# EAGLE design midiprog (EAGLE 6.5.0)
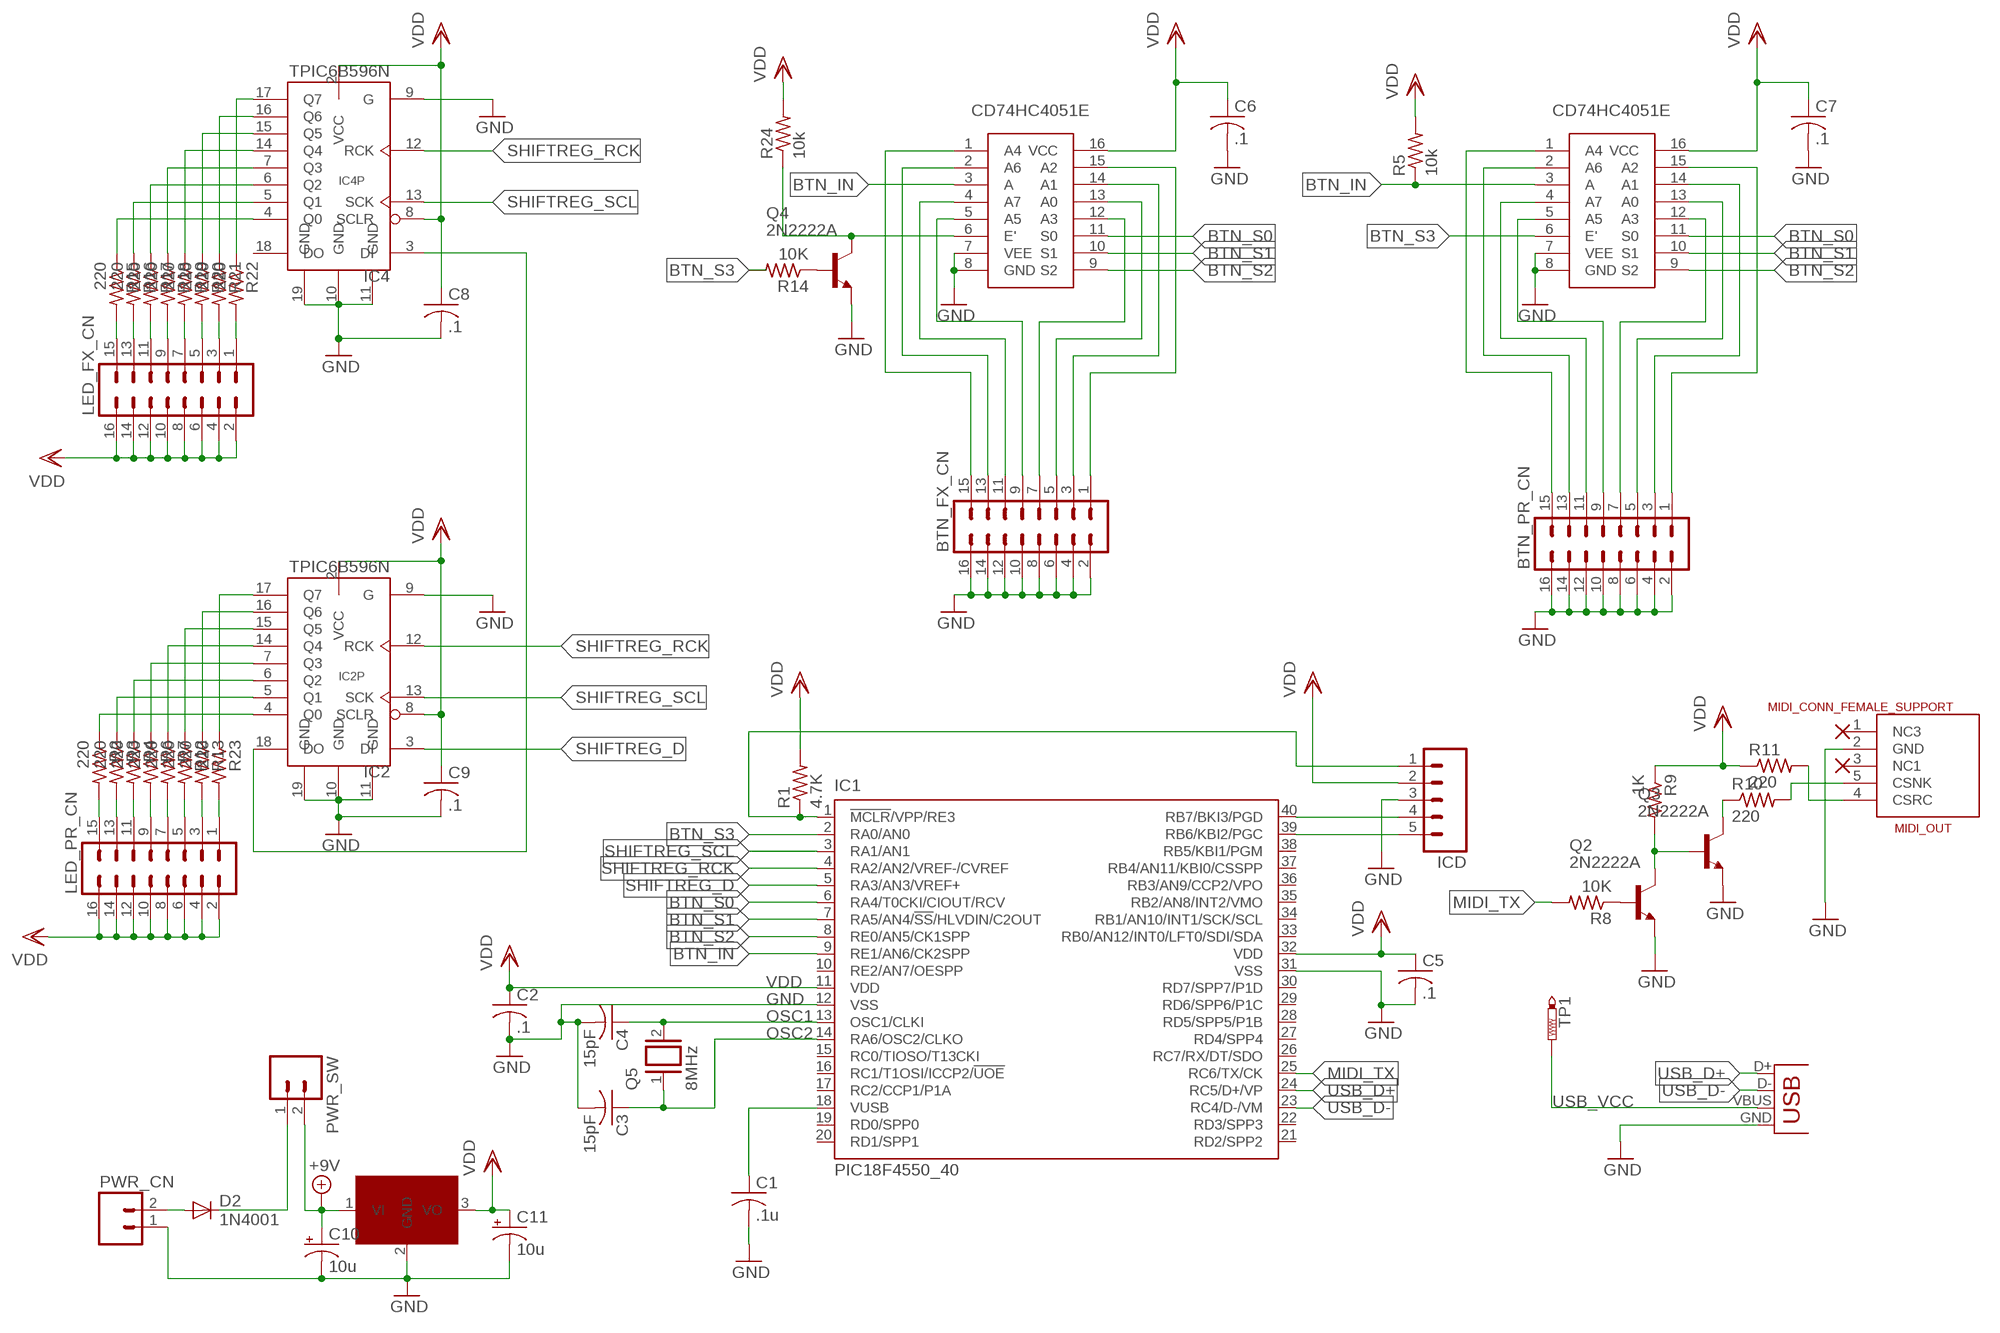
[diagram p0: schematic, sheet 1]

## Parts
BTN_FX_CN  MA08-2  [MA08-2]
BTN_PR_CN  MA08-2  [MA08-2]
C1  .1u  C-US050-025X075  [C050-025X075]
C2  .1  C-US050-025X075  [C050-025X075]
C3  15pF  C-US050-025X075  [C050-025X075]
C4  15pF  C-US050-025X075  [C050-025X075]
C5  .1  C-US050-025X075  [C050-025X075]
C6  .1  C-US050-025X075  [C050-025X075]
C7  .1  C-US050-025X075  [C050-025X075]
C8  .1  C-US050-025X075  [C050-025X075]
C9  .1  C-US050-025X075  [C050-025X075]
C10  10u  CPOL-USE2.5-6  [E2,5-6]
C11  10u  CPOL-USE2.5-6  [E2,5-6]
D2  1N4001  1N4004  [DO41-10]
IC1  PIC18F4550_40  [DIL40]
IC2  TPIC6B596N  [DIL20]
IC4  TPIC6B596N  [DIL20]
ICD  MA05  [05PA]
JP1  USB-B  USBPTH  [USB-B-PTH]
LED_FX_CN  MA08-2  [MA08-2]
LED_PR_CN  MA08-2  [MA08-2]
MIDI_OUT  MIDI_CONN_FEMALE_SUPPORT  [DIN_5_FEMALE_SUPPORT]
PWR_CN  M02  [02P]
PWR_SW  M02  [02P]
Q2  2N2222A  [TO18]
Q3  2N2222A  [TO18]
Q4  2N2222A  [TO18]
Q5  8MHz  XTAL/S  [QS]
R1  4.7K  R-US_0207/10  [0207/10]
R2  220  R-US_0207/10  [0207/10]
R3  220  R-US_0207/10  [0207/10]
R4  220  R-US_0207/10  [0207/10]
R5  10k  R-US_0207/10  [0207/10]
R6  220  R-US_0207/10  [0207/10]
R7  220  R-US_0207/10  [0207/10]
R8  10K  R-US_0207/10  [0207/10]
R9  1K  R-US_0207/10  [0207/10]
R10  220  R-US_0207/10  [0207/10]
R11  220  R-US_0207/10  [0207/10]
R12  220  R-US_0207/10  [0207/10]
R13  220  R-US_0207/10  [0207/10]
R14  10K  R-US_0207/10  [0207/10]
R15  220  R-US_0207/10  [0207/10]
R16  220  R-US_0207/10  [0207/10]
R17  220  R-US_0207/10  [0207/10]
R18  220  R-US_0207/10  [0207/10]
R19  220  R-US_0207/10  [0207/10]
R20  220  R-US_0207/10  [0207/10]
R21  220  R-US_0207/10  [0207/10]
R22  220  R-US_0207/10  [0207/10]
R23  220  R-US_0207/10  [0207/10]
R24  10k  R-US_0207/10  [0207/10]
TP1  PTR1PAD1-17  [P1-17]
U$1  CD74HC4051E  [CD74HC4051E]
U$2  CD74HC4051E  [CD74HC4051E]
U$3  7805  [JKDFJD]

## Nets
+9V: C10.+ PWR_SW.2 U$3.1(VI)
BTN_IN: IC1.9(RE1/AN6/CK2SPP) R5.1 U$1.3(A) U$2.3(A)
BTN_S0: IC1.6(RA4/T0CKI/CIOUT/RCV) U$1.11(S0) U$2.11(S0)
BTN_S1: IC1.7(RA5/AN4/!SS!/HLVDIN/C2OUT) U$1.10(S1) U$2.10(S1)
BTN_S2: IC1.8(RE0/AN5/CK1SPP) U$1.9(S2) U$2.9(S2)
BTN_S3: IC1.2(RA0/AN0) R14.2 U$1.6(E')
GND: BTN_FX_CN.2 BTN_FX_CN.4 BTN_FX_CN.6 BTN_FX_CN.8 BTN_FX_CN.10 BTN_FX_CN.12 BTN_FX_CN.14 BTN_FX_CN.16 BTN_PR_CN.2 BTN_PR_CN.4 BTN_PR_CN.6 BTN_PR_CN.8 BTN_PR_CN.10 BTN_PR_CN.12 BTN_PR_CN.14 BTN_PR_CN.16 C1.2 C2.2 C3.2 C4.2 C5.2 C6.2 C7.2 C8.2 C9.2 C10.- C11.- IC1.12(VSS) IC1.31(VSS) IC2.9(G) IC2.10(GND) IC2.11(GND) IC2.19(GND) IC4.9(G) IC4.10(GND) IC4.11(GND) IC4.19(GND) ICD.3 JP1.GND MIDI_OUT.2(GND) PWR_CN.1 Q2.1(E) Q3.1(E) Q4.1(E) U$1.7(VEE) U$1.8(GND) U$2.7(VEE) U$2.8(GND) U$3.2(GND)
MIDI_TX: IC1.25(RC6/TX/CK) R8.2
N$1: IC1.1(!MCLR!/VPP/RE3) ICD.1 R1.1
N$2: LED_FX_CN.15 R15.2
N$3: LED_FX_CN.13 R16.2
N$4: Q2.2(B) R8.1
N$5: Q2.3(C) Q3.2(B) R9.2
N$6: LED_PR_CN.15 R2.2
N$7: Q3.3(C) R10.1
N$8: MIDI_OUT.4(CSRC) R11.2
N$9: MIDI_OUT.5(CSNK) R10.2
N$10: LED_FX_CN.11 R17.2
N$11: LED_FX_CN.9 R18.2
N$12: LED_FX_CN.7 R19.2
N$13: LED_FX_CN.5 R20.2
N$14: LED_FX_CN.3 R21.2
N$15: LED_FX_CN.1 R22.2
N$16: IC1.39(RB6/KBI2/PGC) ICD.5
N$17: IC1.40(RB7/BKI3/PGD) ICD.4
N$18: C1.1 IC1.18(VUSB)
N$19: IC4.4(Q0) R15.1
N$20: IC4.5(Q1) R16.1
N$21: IC4.6(Q2) R17.1
N$22: IC4.7(Q3) R18.1
N$23: IC4.14(Q4) R19.1
N$24: LED_PR_CN.13 R3.2
N$25: IC4.15(Q5) R20.1
N$26: IC4.16(Q6) R21.1
N$27: LED_PR_CN.11 R4.2
N$28: LED_PR_CN.9 R6.2
N$29: IC4.17(Q7) R22.1
N$30: LED_PR_CN.7 R7.2
N$31: IC2.18(DO) IC4.3(DI)
N$32: LED_PR_CN.5 R12.2
N$34: D2.A PWR_CN.2
N$35: D2.C PWR_SW.1
N$36: LED_PR_CN.3 R13.2
N$37: LED_PR_CN.1 R23.2
N$38: IC2.4(Q0) R2.1
N$39: IC2.5(Q1) R3.1
N$40: IC2.6(Q2) R4.1
N$41: IC2.7(Q3) R6.1
N$42: IC2.14(Q4) R7.1
N$43: IC2.15(Q5) R12.1
N$44: IC2.16(Q6) R13.1
N$45: IC2.17(Q7) R23.1
N$46: BTN_FX_CN.9 U$2.5(A5)
N$47: BTN_PR_CN.9 U$1.5(A5)
N$48: BTN_FX_CN.11 U$2.4(A7)
N$49: BTN_FX_CN.13 U$2.2(A6)
N$50: BTN_PR_CN.11 U$1.4(A7)
N$51: BTN_PR_CN.13 U$1.2(A6)
N$52: BTN_PR_CN.15 U$1.1(A4)
N$53: Q4.2(B) R14.1
N$54: Q4.3(C) R24.1 U$2.6(E')
N$55: BTN_PR_CN.7 U$1.12(A3)
N$56: BTN_PR_CN.5 U$1.13(A0)
N$57: BTN_PR_CN.3 U$1.14(A1)
N$58: BTN_PR_CN.1 U$1.15(A2)
N$60: BTN_FX_CN.15 U$2.1(A4)
N$61: BTN_FX_CN.7 U$2.12(A3)
N$62: BTN_FX_CN.5 U$2.13(A0)
N$63: BTN_FX_CN.3 U$2.14(A1)
N$64: BTN_FX_CN.1 U$2.15(A2)
OSC1: C4.1 IC1.13(OSC1/CLKI) Q5.2
OSC2: C3.1 IC1.14(RA6/OSC2/CLKO) Q5.1
SHIFTREG_D: IC1.5(RA3/AN3/VREF+) IC2.3(DI)
SHIFTREG_RCK: IC1.4(RA2/AN2/VREF-/CVREF) IC2.12(RCK) IC4.12(RCK)
SHIFTREG_SCL: IC1.3(RA1/AN1) IC2.13(SCK) IC4.13(SCK)
USB_D+: IC1.24(RC5/D+/VP) JP1.D+
USB_D-: IC1.23(RC4/D-/VM) JP1.D-
USB_VCC: JP1.VBUS TP1.TP
VDD: C2.1 C5.1 C6.1 C7.1 C8.1 C9.1 C11.+ IC1.11(VDD) IC1.32(VDD) IC2.2(VCC) IC2.8(SCLR) IC4.2(VCC) IC4.8(SCLR) ICD.2 LED_FX_CN.2 LED_FX_CN.4 LED_FX_CN.6 LED_FX_CN.8 LED_FX_CN.10 LED_FX_CN.12 LED_FX_CN.14 LED_FX_CN.16 LED_PR_CN.2 LED_PR_CN.4 LED_PR_CN.6 LED_PR_CN.8 LED_PR_CN.10 LED_PR_CN.12 LED_PR_CN.14 LED_PR_CN.16 R1.2 R5.2 R9.1 R11.1 R24.2 U$1.16(VCC) U$2.16(VCC) U$3.3(VO)
Unconnected: IC1.10(RE2/AN7/OESPP) IC1.15(RC0/TIOSO/T13CKI) IC1.16(RC1/T1OSI/ICCP2/!UOE) IC1.17(RC2/CCP1/P1A) IC1.19(RD0/SPP0) IC1.20(RD1/SPP1) IC1.21(RD2/SPP2) IC1.22(RD3/SPP3) IC1.26(RC7/RX/DT/SDO) IC1.27(RD4/SPP4) IC1.28(RD5/SPP5/P1B) IC1.29(RD6/SPP6/P1C) IC1.30(RD7/SPP7/P1D) IC1.33(RB0/AN12/INT0/LFT0/SDI/SDA) IC1.34(RB1/AN10/INT1/SCK/SCL) IC1.35(RB2/AN8/INT2/VMO) IC1.36(RB3/AN9/CCP2/VPO) IC1.37(RB4/AN11/KBI0/CSSPP) IC1.38(RB5/KBI1/PGM) IC4.18(DO) MIDI_OUT.1(NC3) MIDI_OUT.3(NC1)

## Library data of the parts
BTN_FX_CN BTN_PR_CN LED_FX_CN LED_PR_CN = con-lstb:MA08-2: PIN HEADER; OC_FARNELL: unknown; OC_NEWARK: unknown
C1-C9 = rcl:C-US: CAPACITOR, American symbol
C10 C11 = rcl:CPOL-US: POLARIZED CAPACITOR, American symbol
D2 = diode:1N4004: DIODE general purpose rectifier, 1 A
IC1 = microchip:PIC18F4*_40: USB Microcontrollers with nanoWatt Technology High-Performance, Enhanced Flash, 28/40/44-Pin, Source: http://ww1.microchip.com/downloads/en/devicedoc/39632c.pdf; MF: MICROCHIP; MPN: PIC18F4550-I/P; OC_FARNELL: 9321357; OC_NEWARK: 74K8623
IC2 IC4 = tpic:TPIC6B596
ICD = con-amp-quick:MA05: AMP QUICK CONNECTOR; OC_FARNELL: unknown; OC_NEWARK: unknown
JP1 = SparkFun-Connectors-fdb4deb3ddf02d02cecaec8c0f5c972a585683b1:USB: USB Connectors USB-B-PTH is fully proven SKU : PRT-00139/CONN-08278 USB-miniB is fully proven SKU : PRT-00587 USB-A-PCB is untested. USB-A-H is throughly reviewed, but untested. Spark Fun Electronics SKU : PRT-00437 USB-B-SMT is throughly reviewed, but untested. Needs silkscreen touching up. USB-A-S has not been used/tested USB-MB-H has not been used/tested USB-MICROB has been used. CONN-09505; PROD_ID: CONN-08278
MIDI_OUT = SparkFun-Connectors-fdb4deb3ddf02d02cecaec8c0f5c972a585683b1:MIDI_CONN_FEMALE_SUPPORT: MIDI connector with strain relief (DIN-5 female)
PWR_CN PWR_SW = con-amp-quick:M02: AMP QUICK CONNECTOR; OC_FARNELL: unknown; OC_NEWARK: unknown
Q2-Q4 = transistor-npn:2N2222*: NPN Transistor
Q5 = special:XTAL/S: CRYSTAL
R1-R24 = rcl:R-US_: RESISTOR, American symbol
TP1 = testpad:PTR1: TEST PIN
U$1 U$2 = joe:CD74HC4051E
U$3 = 7805:7805

## Board
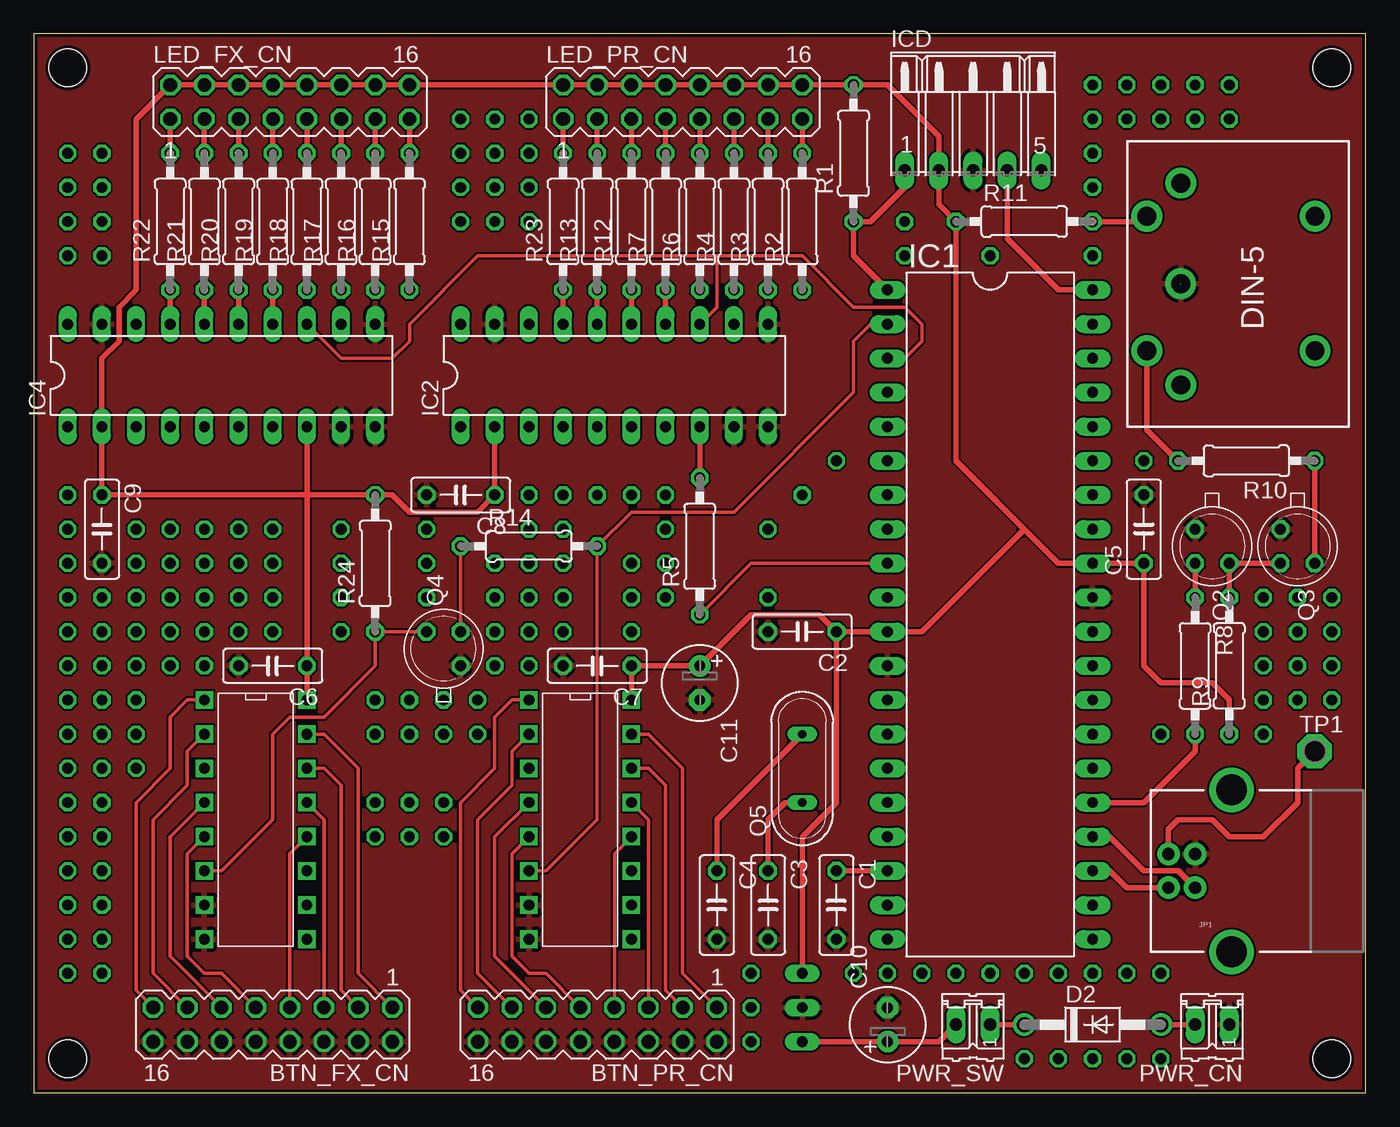
[diagram p1: board, top side]
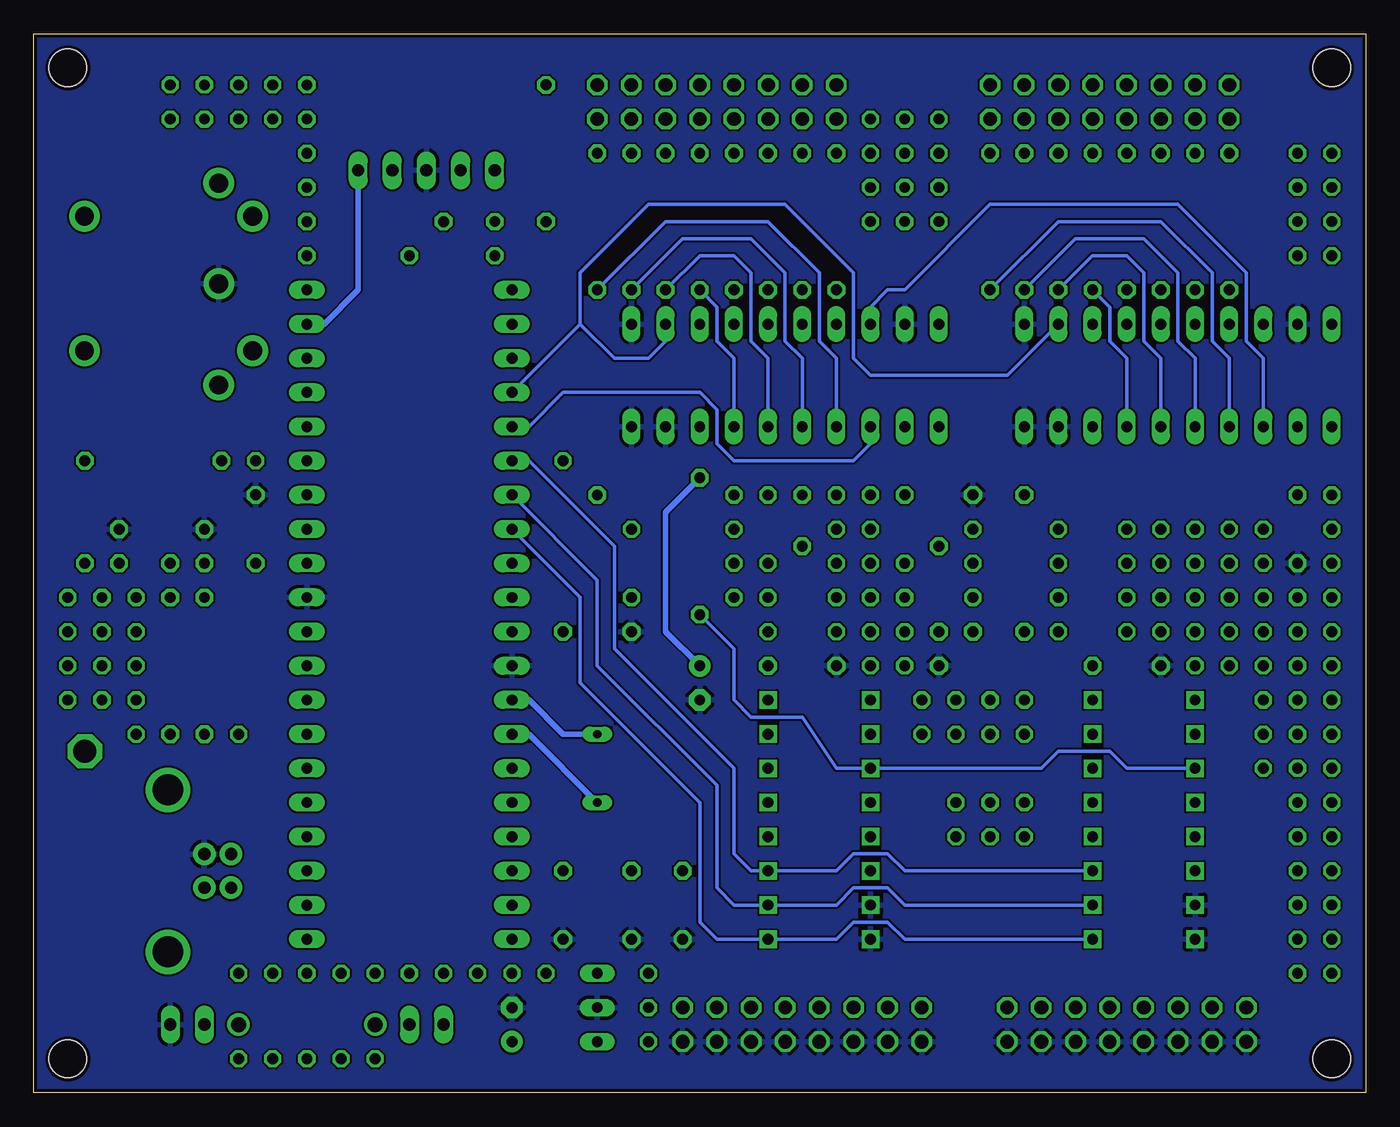
[diagram p2: board, bottom side, seen from below]

Size 99.06 x 78.74 mm. Coordinates in mm from the lower left corner, seen from the top.
Outline: 0,0 99.06,0 99.06,78.74 0,78.74 0,0
Copper layers (1*16): Top 0.035mm / dielectric 1.5mm / Bottom 0.035mm
Design rules "SeeedStudio_DRU-2layer_no_angle_20130527": minimum track width 6mil, minimum drill 12mil, track to track 6mil, track to pad 6mil, pad to pad 6mil, via to via 6mil, smd to smd 0mil, copper to edge 10mil, drill to drill 10mil, minimum pad ring 10mil, minimum via ring 6mil, stop-mask expansion 2mil, vias tented up to drill 25mil, thermal gap 10mil
Holes 2.8 mm at 2.54,76.2 2.54,2.54 96.52,2.54 96.52,76.2

### Footprints (pad centres in the part's own frame; a part is rotated, then mirrored left to right if it is on the bottom)
MA08-2 = drill 1.016 octagon: 1 -8.89,-1.27; 2 -8.89,1.27; 3 -6.35,-1.27; 4 -6.35,1.27; 5 -3.81,-1.27; 6 -3.81,1.27; 7 -1.27,-1.27; 8 -1.27,1.27; 9 1.27,-1.27; 10 1.27,1.27; 11 3.81,-1.27; 12 3.81,1.27; 13 6.35,-1.27; 14 6.35,1.27; 15 8.89,-1.27; 16 8.89,1.27
C050-025X075 = drill 0.813 octagon: 1 -2.54,0; 2 2.54,0
E2,5-6 = drill 0.813 pad 1.6: + -1.27,0 | drill 0.813 pad 1.6 octagon: - 1.27,0
DO41-10 = drill 1.118: A 5.08,0; C -5.08,0
DIL40 = drill 0.813 long: 1 -24.13,-7.62; 2 -21.59,-7.62; 3 -19.05,-7.62; 4 -16.51,-7.62; 5 -13.97,-7.62; 6 -11.43,-7.62; 7 -8.89,-7.62; 8 -6.35,-7.62; 9 -3.81,-7.62; 10 -1.27,-7.62; 11 1.27,-7.62; 12 3.81,-7.62; 13 6.35,-7.62; 14 8.89,-7.62; 15 11.43,-7.62; 16 13.97,-7.62; 17 16.51,-7.62; 18 19.05,-7.62; 19 21.59,-7.62; 20 24.13,-7.62; 21 24.13,7.62; 22 21.59,7.62; 23 19.05,7.62; 24 16.51,7.62; 25 13.97,7.62; 26 11.43,7.62; 27 8.89,7.62; 28 6.35,7.62; 29 3.81,7.62; 30 1.27,7.62; 31 -1.27,7.62; 32 -3.81,7.62; 33 -6.35,7.62; 34 -8.89,7.62; 35 -11.43,7.62; 36 -13.97,7.62; 37 -16.51,7.62; 38 -19.05,7.62; 39 -21.59,7.62; 40 -24.13,7.62
DIL20 = drill 0.813 long: 1 -11.43,-3.81; 2 -8.89,-3.81; 3 -6.35,-3.81; 4 -3.81,-3.81; 5 -1.27,-3.81; 6 1.27,-3.81; 7 3.81,-3.81; 8 6.35,-3.81; 9 8.89,-3.81; 10 11.43,-3.81; 11 11.43,3.81; 12 8.89,3.81; 13 6.35,3.81; 14 3.81,3.81; 15 1.27,3.81; 16 -1.27,3.81; 17 -3.81,3.81; 18 -6.35,3.81; 19 -8.89,3.81; 20 -11.43,3.81
05PA = drill 0.914 long: 1 -5.08,0; 2 -2.54,0; 3 0,0; 4 2.54,0; 5 5.08,0
USB-B-PTH = drill 0.914 pad 1.676: D+ 0,1.25; D- 1.981,1.25; GND 0,-1.25; VBUS 1.981,-1.25 | drill 2.286: S1 -2.718,-6.02; S2 -2.718,6.02
DIN_5_FEMALE_SUPPORT = drill 1.4 pad 2.286: 1 7.94,3.6; 2 0.46,3.61; 3 -7.07,3.6; 4 5.47,6.13; 5 -4.53,6.12; 6 -4.53,-6.382; 7 5.478,-6.382
02P = drill 0.914 long: 1 -1.27,0; 2 1.27,0
TO18 = drill 0.813 octagon: 1 -1.27,-1.27; 2 1.27,-1.27; 3 1.27,1.27
QS = drill 0.61 long: 1 -2.54,0; 2 2.54,0
0207/10 = drill 0.813 octagon: 1 -5.08,0; 2 5.08,0
P1-17 = drill 1.702 pad 2.54 octagon: TP 0,0
CD74HC4051E = drill 0.8 square: 1 -10.16,-7.62; 2 -7.62,-7.62; 3 -5.08,-7.62; 4 -2.54,-7.62; 5 0,-7.62; 6 2.54,-7.62; 7 5.08,-7.62; 8 7.62,-7.62; 9 7.62,0; 10 5.08,0; 11 2.54,0; 12 0,0; 13 -2.54,0; 14 -5.08,0; 15 -7.62,0; 16 -10.16,0
JKDFJD = drill 0.8 long: 1 -2.54,0; 2 0,0; 3 2.54,0

### Placement (x,y rotation side)
BTN_FX_CN  17.78,5.08 180 top
BTN_PR_CN  41.91,5.08 180 top
C1  59.69,13.97 270 top
C2  57.15,34.29 180 top
C3  54.61,13.97 270 top
C4  50.8,13.97 270 top
C5  82.55,41.91 90 top
C6  17.78,31.75 180 top
C7  41.91,31.75 180 top
C8  31.75,44.45 180 top
C9  5.08,41.91 270 top
C10  63.5,5.08 90 top
C11  49.53,30.48 270 top
D2  78.74,5.08 0 top
IC1  71.12,35.56 270 top
IC2  43.18,53.34 0 top
IC4  13.97,53.34 0 top
ICD  69.85,68.58 0 top
JP1  86.36,16.51 180 top
LED_FX_CN  19.05,73.66 0 top
LED_PR_CN  48.26,73.66 0 top
MIDI_OUT  88.9,59.69 90 top
PWR_CN  87.63,5.08 180 top
PWR_SW  69.85,5.08 180 top
Q2  87.63,40.64 270 top
Q3  93.98,40.64 270 top
Q4  30.48,33.02 90 top
Q5  57.15,24.13 90 top
R1  60.96,69.85 90 top
R2  57.15,64.77 90 top
R3  54.61,64.77 90 top
R4  52.07,64.77 90 top
R5  49.53,40.64 90 top
R6  49.53,64.77 90 top
R7  46.99,64.77 90 top
R8  86.36,31.75 270 top
R9  88.9,31.75 90 top
R10  90.17,46.99 180 top
R11  73.66,64.77 0 top
R12  44.45,64.77 90 top
R13  41.91,64.77 90 top
R14  36.83,40.64 0 top
R15  27.94,64.77 90 top
R16  25.4,64.77 90 top
R17  22.86,64.77 90 top
R18  20.32,64.77 90 top
R19  17.78,64.77 90 top
R20  15.24,64.77 90 top
R21  12.7,64.77 90 top
R22  10.16,64.77 90 top
R23  39.37,64.77 90 top
R24  25.4,39.37 90 top
TP1  95.25,25.4 0 top
U$1  44.45,19.05 270 top
U$2  20.32,19.05 270 top
U$3  57.15,6.35 90 top

### Tracks (layer width: path | path; a pad name or v marks a point on that pad's centre or on a via)
+9V
  Top 0.406: U$3.1 C10.+ 67.31,3.81 PWR_SW.2
BTN_IN
  Top 0.254: IC1.9 53.34,39.37 R5.1
  Bottom 0.254: R5.1 46.99,33.02 46.99,29.21 45.72,27.94 41.91,27.94 39.37,24.13 U$1.3 24.13,24.13 22.86,25.4 19.05,25.4 17.78,24.13 U$2.3
BTN_S0
  Bottom 0.254: IC1.6 62.23,46.99 55.88,40.64 55.88,33.02 46.99,24.13 46.99,17.78 45.72,16.51 U$1.11 39.37,16.51 38.1,17.78 35.56,17.78 34.29,16.51 U$2.11
BTN_S1
  Bottom 0.254: IC1.7 57.15,38.1 57.15,31.75 48.26,22.86 48.26,15.24 46.99,13.97 U$1.10 39.37,13.97 38.1,15.24 35.56,15.24 34.29,13.97 U$2.10
BTN_S2
  Bottom 0.254: IC1.8 58.42,36.83 58.42,30.48 49.53,21.59 49.53,12.7 48.26,11.43 U$1.9 39.37,11.43 38.1,12.7 35.56,12.7 34.29,11.43 U$2.9
BTN_S3
  Top 0.254: IC1.2 62.23,57.15 60.96,55.88 60.96,52.07 52.07,43.18 44.45,43.18 R14.2 41.91,20.32 38.1,16.51 U$1.6
GND
  pour Bottom: -1.27,80.01 100.33,80.01 100.33,-1.27 -1.27,-1.27
  pour Top: -2.54,81.28 101.6,81.28 101.6,-2.54 -2.54,-2.54
MIDI_TX
  Top 0.406: IC1.25 82.55,21.59 86.36,25.4 R8.2
N$1
  Top 0.406: ICD.1 64.77,67.31 62.23,64.77 R1.1 60.96,62.23 IC1.1
N$2
  Top 0.406: LED_FX_CN.15 R15.2
N$3
  Top 0.406: LED_FX_CN.13 R16.2
N$4
  Top 0.406: R8.1 Q2.2
N$5
  Top 0.406: R9.2 Q2.3 Q3.2
N$6
  Top 0.406: LED_PR_CN.15 R2.2
N$7
  Top 0.406: Q3.3 R10.1
N$8
  Top 0.406: R11.2 82.38,64.77 MIDI_OUT.4
N$9
  Top 0.406: MIDI_OUT.5 82.78,49.3 R10.2
N$10
  Top 0.406: LED_FX_CN.11 R17.2
N$11
  Top 0.406: LED_FX_CN.9 R18.2
N$12
  Top 0.406: LED_FX_CN.7 R19.2
N$13
  Top 0.406: LED_FX_CN.5 R20.2
N$14
  Top 0.406: LED_FX_CN.3 R21.2
N$15
  Top 0.406: LED_FX_CN.1 R22.2
N$16
  Bottom 0.406: ICD.5 74.93,59.69 77.47,57.15 IC1.39
N$17
  Top 0.406: ICD.4 72.39,63.5 76.2,59.69 IC1.40
N$18
  Top 0.406: IC1.18 C1.1
N$19
  Bottom 0.254: IC4.4 10.16,54.61 11.43,55.88 11.43,60.96 15.24,64.77 22.86,64.77 R15.1
N$20
  Bottom 0.254: IC4.5 12.7,54.61 13.97,55.88 13.97,60.96 16.51,63.5 21.59,63.5 R16.1
N$21
  Bottom 0.254: IC4.6 15.24,54.61 16.51,55.88 16.51,60.96 17.78,62.23 20.32,62.23 R17.1
N$22
  Bottom 0.254: IC4.7 17.78,54.61 19.05,55.88 19.05,58.42 R18.1
N$23
  Top 0.406: R19.1 IC4.14
N$24
  Top 0.406: LED_PR_CN.13 R3.2
N$25
  Top 0.406: R20.1 IC4.15
N$26
  Top 0.406: R21.1 IC4.16
N$27
  Top 0.406: LED_PR_CN.11 R4.2
N$28
  Top 0.406: LED_PR_CN.9 R6.2
N$29
  Top 0.406: R22.1 IC4.17
N$30
  Top 0.406: LED_PR_CN.7 R7.2
N$31
  Bottom 0.254: IC4.3 7.62,54.61 8.89,55.88 8.89,60.96 13.97,66.04 27.94,66.04 34.29,59.69 35.56,59.69 36.83,58.42 IC2.18
N$32
  Top 0.406: LED_PR_CN.5 R12.2
N$33  (via drill 0.8 pad 1.27)
  other vias: 17.78,41.91
N$34
  Top 0.406: D2.A PWR_CN.2
N$35
  Top 0.406: PWR_SW.1 D2.C
N$36
  Top 0.406: LED_PR_CN.3 R13.2
N$37
  Top 0.406: LED_PR_CN.1 R23.2
N$38
  Bottom 0.254: IC2.4 39.37,54.61 40.64,55.88 40.64,60.96 44.45,64.77 52.07,64.77 R2.1
N$39
  Bottom 0.254: IC2.5 41.91,54.61 43.18,55.88 43.18,60.96 45.72,63.5 50.8,63.5 R3.1
N$40
  Bottom 0.254: IC2.6 44.45,54.61 45.72,55.88 45.72,60.96 46.99,62.23 49.53,62.23 R4.1
N$41
  Bottom 0.254: IC2.7 46.99,54.61 48.26,55.88 48.26,58.42 R6.1
N$42
  Top 0.406: R7.1 IC2.14
N$43
  Top 0.406: R12.1 IC2.15
N$44
  Top 0.406: R13.1 IC2.16
N$45
  Top 0.406: R23.1 IC2.17
N$46
  Top 0.254: U$2.5 11.43,17.78 11.43,10.16 12.7,8.89 13.97,8.89 BTN_FX_CN.9
N$47
  Top 0.254: U$1.5 35.56,17.78 35.56,10.16 36.83,8.89 38.1,8.89 BTN_PR_CN.9
N$48
  Top 0.254: U$2.4 10.16,19.05 10.16,10.16 BTN_FX_CN.11
N$49
  Top 0.254: U$2.2 11.43,25.4 11.43,22.86 8.89,20.32 8.89,8.89 BTN_FX_CN.13
N$50
  Top 0.254: U$1.4 34.29,19.05 34.29,10.16 BTN_PR_CN.11
N$51
  Top 0.254: U$1.2 35.56,25.4 35.56,22.86 33.02,20.32 33.02,8.89 BTN_PR_CN.13
N$52
  Top 0.254: U$1.1 35.56,29.21 34.29,27.94 34.29,24.13 31.75,21.59 31.75,7.62 BTN_PR_CN.15
N$53
  Top 0.254: R14.1 Q4.2
N$54
  Top 0.254: Q4.3 R24.1 25.4,31.75 21.59,27.94 19.05,27.94 17.78,26.67 17.78,20.32 13.97,16.51 U$2.6
N$55
  Top 0.254: U$1.12 43.18,17.78 BTN_PR_CN.7
N$56
  Top 0.254: U$1.13 45.72,20.32 BTN_PR_CN.5
N$57
  Top 0.254: U$1.14 45.72,24.13 46.99,22.86 46.99,7.62 BTN_PR_CN.3
N$58
  Top 0.254: U$1.15 45.72,26.67 48.26,24.13 48.26,8.89 BTN_PR_CN.1
N$59  (via drill 0.8 pad 1.27)
  other vias: 15.24,41.91
N$60
  Top 0.254: U$2.1 11.43,29.21 10.16,27.94 10.16,24.13 7.62,21.59 7.62,7.62 BTN_FX_CN.15
N$61
  Top 0.254: U$2.12 19.05,17.78 BTN_FX_CN.7
N$62
  Top 0.254: U$2.13 21.59,20.32 BTN_FX_CN.5
N$63
  Top 0.254: U$2.14 21.59,24.13 22.86,22.86 22.86,7.62 BTN_FX_CN.3
N$64
  Top 0.254: U$2.15 21.59,26.67 24.13,24.13 24.13,8.89 BTN_FX_CN.1
N$65  (via drill 0.8 pad 1.27)
  other vias: 12.7,41.91
N$66  (via drill 0.8 pad 1.27)
  other vias: 10.16,41.91
N$67  (via drill 0.8 pad 1.27)
  other vias: 10.16,39.37
N$68  (via drill 0.8 pad 1.27)
  other vias: 12.7,39.37
N$69  (via drill 0.8 pad 1.27)
  other vias: 15.24,39.37
N$70  (via drill 0.8 pad 1.27)
  other vias: 17.78,39.37
N$71  (via drill 0.8 pad 1.27)
  other vias: 17.78,36.83
N$72  (via drill 0.8 pad 1.27)
  other vias: 15.24,36.83
N$73  (via drill 0.8 pad 1.27)
  other vias: 12.7,36.83
N$74  (via drill 0.8 pad 1.27)
  other vias: 10.16,36.83
N$75  (via drill 0.8 pad 1.27)
  other vias: 10.16,34.29
N$76  (via drill 0.8 pad 1.27)
  other vias: 12.7,34.29
N$77  (via drill 0.8 pad 1.27)
  other vias: 15.24,34.29
N$78  (via drill 0.8 pad 1.27)
  other vias: 17.78,34.29
N$79  (via drill 0.8 pad 1.27)
  other vias: 7.62,36.83
N$80  (via drill 0.8 pad 1.27)
  other vias: 7.62,34.29
N$81  (via drill 0.8 pad 1.27)
  other vias: 7.62,31.75
N$82  (via drill 0.8 pad 1.27)
  other vias: 10.16,31.75
N$83  (via drill 0.8 pad 1.27)
  other vias: 12.7,31.75
N$84  (via drill 0.8 pad 1.27)
  other vias: 5.08,31.75
N$85  (via drill 0.8 pad 1.27)
  other vias: 5.08,34.29
N$86  (via drill 0.8 pad 1.27)
  other vias: 5.08,36.83
N$87  (via drill 0.8 pad 1.27)
  other vias: 2.54,36.83
N$88  (via drill 0.8 pad 1.27)
  other vias: 2.54,39.37
N$89  (via drill 0.8 pad 1.27)
  other vias: 2.54,41.91
N$90  (via drill 0.8 pad 1.27)
  other vias: 7.62,41.91
N$91  (via drill 0.8 pad 1.27)
  other vias: 7.62,39.37
N$92  (via drill 0.8 pad 1.27)
  other vias: 2.54,34.29
N$93  (via drill 0.8 pad 1.27)
  other vias: 2.54,31.75
N$94  (via drill 0.8 pad 1.27)
  other vias: 33.02,29.21
N$95  (via drill 0.8 pad 1.27)
  other vias: 30.48,29.21
N$96  (via drill 0.8 pad 1.27)
  other vias: 5.08,69.85
N$97  (via drill 0.8 pad 1.27)
  other vias: 2.54,69.85
N$98  (via drill 0.8 pad 1.27)
  other vias: 2.54,67.31
N$99  (via drill 0.8 pad 1.27)
  other vias: 5.08,67.31
N$100  (via drill 0.8 pad 1.27)
  other vias: 5.08,64.77
N$101  (via drill 0.8 pad 1.27)
  other vias: 2.54,64.77
N$102  (via drill 0.8 pad 1.27)
  other vias: 2.54,62.23
N$103  (via drill 0.8 pad 1.27)
  other vias: 44.45,36.83
N$104  (via drill 0.8 pad 1.27)
  other vias: 34.29,36.83
N$105  (via drill 0.8 pad 1.27)
  other vias: 34.29,34.29
N$106  (via drill 0.8 pad 1.27)
  other vias: 44.45,34.29
N$107  (via drill 0.8 pad 1.27)
  other vias: 46.99,44.45
N$108  (via drill 0.8 pad 1.27)
  other vias: 46.99,36.83
N$109  (via drill 0.8 pad 1.27)
  other vias: 93.98,36.83
N$110  (via drill 0.8 pad 1.27)
  other vias: 93.98,34.29
N$111  (via drill 0.8 pad 1.27)
  other vias: 2.54,44.45
N$112  (via drill 0.8 pad 1.27)
  other vias: 5.08,62.23
N$113  (via drill 0.8 pad 1.27)
  other vias: 78.74,67.31
N$114  (via drill 0.8 pad 1.27)
  other vias: 78.74,69.85
N$115  (via drill 0.8 pad 1.27)
  other vias: 78.74,72.39
N$116  (via drill 0.8 pad 1.27)
  other vias: 78.74,74.93
N$117  (via drill 0.8 pad 1.27)
  other vias: 81.28,74.93
N$118  (via drill 0.8 pad 1.27)
  other vias: 81.28,72.39
N$119  (via drill 0.8 pad 1.27)
  other vias: 83.82,72.39
N$120  (via drill 0.8 pad 1.27)
  other vias: 83.82,74.93
N$121  (via drill 0.8 pad 1.27)
  other vias: 86.36,74.93
N$122  (via drill 0.8 pad 1.27)
  other vias: 86.36,72.39
N$123  (via drill 0.8 pad 1.27)
  other vias: 88.9,72.39
N$124  (via drill 0.8 pad 1.27)
  other vias: 88.9,74.93
N$125  (via drill 0.8 pad 1.27)
  other vias: 27.94,29.21
N$126  (via drill 0.8 pad 1.27)
  other vias: 25.4,29.21
N$127  (via drill 0.8 pad 1.27)
  other vias: 82.55,46.99
N$129  (via drill 0.8 pad 1.27)
  other vias: 36.83,64.77
N$130  (via drill 0.8 pad 1.27)
  other vias: 34.29,64.77
N$131  (via drill 0.8 pad 1.27)
  other vias: 31.75,64.77
N$132  (via drill 0.8 pad 1.27)
  other vias: 31.75,67.31
N$133  (via drill 0.8 pad 1.27)
  other vias: 34.29,67.31
N$134  (via drill 0.8 pad 1.27)
  other vias: 36.83,67.31
N$135  (via drill 0.8 pad 1.27)
  other vias: 36.83,69.85
N$136  (via drill 0.8 pad 1.27)
  other vias: 34.29,69.85
N$137  (via drill 0.8 pad 1.27)
  other vias: 31.75,69.85
N$138  (via drill 0.8 pad 1.27)
  other vias: 31.75,72.39
N$139  (via drill 0.8 pad 1.27)
  other vias: 34.29,72.39
N$140  (via drill 0.8 pad 1.27)
  other vias: 36.83,72.39
N$141  (via drill 0.8 pad 1.27)
  other vias: 7.62,29.21
N$142  (via drill 0.8 pad 1.27)
  other vias: 5.08,29.21
N$143  (via drill 0.8 pad 1.27)
  other vias: 2.54,29.21
N$144  (via drill 0.8 pad 1.27)
  other vias: 2.54,26.67
N$145  (via drill 0.8 pad 1.27)
  other vias: 5.08,26.67
N$146  (via drill 0.8 pad 1.27)
  other vias: 7.62,26.67
N$147  (via drill 0.8 pad 1.27)
  other vias: 7.62,24.13
N$148  (via drill 0.8 pad 1.27)
  other vias: 5.08,24.13
N$149  (via drill 0.8 pad 1.27)
  other vias: 2.54,24.13
N$150  (via drill 0.8 pad 1.27)
  other vias: 73.66,8.89
N$151  (via drill 0.8 pad 1.27)
  other vias: 83.82,8.89
N$152  (via drill 0.8 pad 1.27)
  other vias: 53.34,8.89
N$153  (via drill 0.8 pad 1.27)
  other vias: 53.34,6.35
N$154  (via drill 0.8 pad 1.27)
  other vias: 53.34,3.81
N$155  (via drill 0.8 pad 1.27)
  other vias: 93.98,31.75
N$156  (via drill 0.8 pad 1.27)
  other vias: 93.98,29.21
N$157  (via drill 0.8 pad 1.27)
  other vias: 96.52,29.21
N$158  (via drill 0.8 pad 1.27)
  other vias: 96.52,31.75
N$159  (via drill 0.8 pad 1.27)
  other vias: 96.52,34.29
N$160  (via drill 0.8 pad 1.27)
  other vias: 96.52,36.83
N$161  (via drill 0.8 pad 1.27)
  other vias: 78.74,62.23
N$162  (via drill 0.8 pad 1.27)
  other vias: 64.77,64.77
N$163  (via drill 0.8 pad 1.27)
  other vias: 64.77,62.23
N$164  (via drill 0.8 pad 1.27)
  other vias: 71.12,62.23
N$165  (via drill 0.8 pad 1.27)
  other vias: 71.12,8.89
N$166  (via drill 0.8 pad 1.27)
  other vias: 68.58,8.89
N$167  (via drill 0.8 pad 1.27)
  other vias: 81.28,8.89
N$168  (via drill 0.8 pad 1.27)
  other vias: 78.74,8.89
N$169  (via drill 0.8 pad 1.27)
  other vias: 76.2,8.89
N$170  (via drill 0.8 pad 1.27)
  other vias: 73.66,2.54
N$171  (via drill 0.8 pad 1.27)
  other vias: 76.2,2.54
N$172  (via drill 0.8 pad 1.27)
  other vias: 78.74,2.54
N$173  (via drill 0.8 pad 1.27)
  other vias: 81.28,2.54
N$174  (via drill 0.8 pad 1.27)
  other vias: 83.82,2.54
N$175  (via drill 0.8 pad 1.27)
  other vias: 66.04,8.89
N$176  (via drill 0.8 pad 1.27)
  other vias: 63.5,8.89
N$177  (via drill 0.8 pad 1.27)
  other vias: 60.96,8.89
N$178  (via drill 0.8 pad 1.27)
  other vias: 5.08,21.59
N$179  (via drill 0.8 pad 1.27)
  other vias: 2.54,21.59
N$180  (via drill 0.8 pad 1.27)
  other vias: 2.54,19.05
N$181  (via drill 0.8 pad 1.27)
  other vias: 91.44,26.67
N$182  (via drill 0.8 pad 1.27)
  other vias: 83.82,26.67
N$183  (via drill 0.8 pad 1.27)
  other vias: 5.08,19.05
N$184  (via drill 0.8 pad 1.27)
  other vias: 5.08,16.51
N$185  (via drill 0.8 pad 1.27)
  other vias: 2.54,16.51
N$186  (via drill 0.8 pad 1.27)
  other vias: 2.54,13.97
N$187  (via drill 0.8 pad 1.27)
  other vias: 91.44,29.21
N$188  (via drill 0.8 pad 1.27)
  other vias: 91.44,31.75
N$189  (via drill 0.8 pad 1.27)
  other vias: 91.44,34.29
N$190  (via drill 0.8 pad 1.27)
  other vias: 91.44,36.83
N$191  (via drill 0.8 pad 1.27)
  other vias: 5.08,13.97
N$192  (via drill 0.8 pad 1.27)
  other vias: 5.08,11.43
N$193  (via drill 0.8 pad 1.27)
  other vias: 2.54,11.43
N$194  (via drill 0.8 pad 1.27)
  other vias: 2.54,8.89
N$195  (via drill 0.8 pad 1.27)
  other vias: 5.08,8.89
N$200  (via drill 0.8 pad 1.27)
  other vias: 29.21,39.37
N$201  (via drill 0.8 pad 1.27)
  other vias: 29.21,36.83
N$202  (via drill 0.8 pad 1.27)
  other vias: 36.83,36.83
N$203  (via drill 0.8 pad 1.27)
  other vias: 39.37,36.83
N$204  (via drill 0.8 pad 1.27)
  other vias: 39.37,34.29
N$205  (via drill 0.8 pad 1.27)
  other vias: 36.83,34.29
N$206  (via drill 0.8 pad 1.27)
  other vias: 36.83,31.75
N$207  (via drill 0.8 pad 1.27)
  other vias: 34.29,31.75
N$208  (via drill 0.8 pad 1.27)
  other vias: 22.86,34.29
N$209  (via drill 0.8 pad 1.27)
  other vias: 22.86,36.83
N$210  (via drill 0.8 pad 1.27)
  other vias: 22.86,39.37
N$211  (via drill 0.8 pad 1.27)
  other vias: 22.86,41.91
N$212  (via drill 0.8 pad 1.27)
  other vias: 36.83,41.91
N$213  (via drill 0.8 pad 1.27)
  other vias: 39.37,41.91
N$214  (via drill 0.8 pad 1.27)
  other vias: 41.91,44.45
N$215  (via drill 0.8 pad 1.27)
  other vias: 54.61,36.83
N$216  (via drill 0.8 pad 1.27)
  other vias: 39.37,44.45
N$217  (via drill 0.8 pad 1.27)
  other vias: 36.83,44.45
N$218  (via drill 0.8 pad 1.27)
  other vias: 44.45,39.37
N$219  (via drill 0.8 pad 1.27)
  other vias: 46.99,41.91
N$220  (via drill 0.8 pad 1.27)
  other vias: 46.99,39.37
N$221  (via drill 0.8 pad 1.27)
  other vias: 44.45,44.45
N$222  (via drill 0.8 pad 1.27)
  other vias: 54.61,41.91
N$223  (via drill 0.8 pad 1.27)
  other vias: 57.15,44.45
N$224  (via drill 0.8 pad 1.27)
  other vias: 59.69,46.99
N$226  (via drill 0.8 pad 1.27)
  other vias: 25.4,26.67
N$227  (via drill 0.8 pad 1.27)
  other vias: 27.94,26.67
N$228  (via drill 0.8 pad 1.27)
  other vias: 30.48,26.67
N$229  (via drill 0.8 pad 1.27)
  other vias: 33.02,26.67
N$230  (via drill 0.8 pad 1.27)
  other vias: 25.4,21.59
N$231  (via drill 0.8 pad 1.27)
  other vias: 27.94,21.59
N$232  (via drill 0.8 pad 1.27)
  other vias: 30.48,21.59
N$233  (via drill 0.8 pad 1.27)
  other vias: 30.48,19.05
N$234  (via drill 0.8 pad 1.27)
  other vias: 27.94,19.05
N$235  (via drill 0.8 pad 1.27)
  other vias: 25.4,19.05
N$236  (via drill 0.8 pad 1.27)
  other vias: 29.21,41.91
N$237  (via drill 0.8 pad 1.27)
  other vias: 39.37,39.37
N$238  (via drill 0.8 pad 1.27)
  other vias: 36.83,39.37
N$239  (via drill 0.8 pad 1.27)
  other vias: 34.29,39.37
OSC1
  Top 0.406: C4.1 50.8,20.32 Q5.2
  Bottom 0.406: Q5.2 59.69,26.67 62.23,29.21 IC1.13
OSC2
  Top 0.406: Q5.1 55.88,21.59 54.61,20.32 C3.1
  Bottom 0.406: Q5.1 62.23,26.67 IC1.14
SHIFTREG_D
  Bottom 0.254: IC2.3 36.83,48.26 38.1,46.99 46.99,46.99 48.26,48.26 48.26,50.8 49.53,52.07 59.69,52.07 62.23,49.53 IC1.5
SHIFTREG_RCK
  Bottom 0.254: IC4.12 26.67,53.34 36.83,53.34 38.1,54.61 38.1,60.96 43.18,66.04 53.34,66.04 58.42,60.96 58.42,57.15 | 58.42,57.15 IC1.4 | IC2.12 52.07,55.88 53.34,54.61 55.88,54.61 58.42,57.15
SHIFTREG_SCL
  Top 0.254: IC4.13 22.86,54.61 26.67,54.61 27.94,55.88 27.94,57.15 33.02,62.23 50.8,62.23 | 50.8,62.23 57.15,62.23 60.96,58.42 64.77,58.42 66.04,57.15 66.04,55.88 64.77,54.61 IC1.3 | IC2.13 50.8,58.42 50.8,62.23
USB_D+
  Top 0.406: IC1.24 80.01,19.05 82.55,16.51 85.11,16.51 JP1.D+
USB_D-
  Top 0.406: IC1.23 80.01,16.51 81.28,15.24 84.36,15.24 JP1.D-
USB_VCC
  Top 0.406: JP1.VBUS 84.38,19.61 85.09,20.32 87.63,20.32 88.9,19.05 91.44,19.05 93.98,21.59 93.98,24.13 TP1.TP
VDD
  Top 0.406: IC2.2 C8.1 33.02,43.18 27.94,43.18 26.67,44.45 R24.2 20.32,44.45 | R9.1 88.9,29.21 87.63,30.48 83.82,30.48 82.55,31.75 C5.1 IC1.32 76.2,39.37 73.66,41.91 | U$1.16 C7.1 C11.+ 53.34,35.56 58.42,35.56 C2.1 | 73.66,41.91 68.58,46.99 R11.1 67.31,66.04 ICD.2 67.31,71.12 63.5,74.93 R1.2 LED_PR_CN.16 LED_PR_CN.14 LED_PR_CN.12 LED_PR_CN.10 LED_PR_CN.8 LED_PR_CN.6 LED_PR_CN.4 LED_PR_CN.2 LED_FX_CN.16 LED_FX_CN.14 LED_FX_CN.12 LED_FX_CN.10 LED_FX_CN.8 LED_FX_CN.6 LED_FX_CN.4 LED_FX_CN.2 7.62,72.39 7.62,59.69 6.35,58.42 6.35,55.88 5.08,54.61 IC4.2 C9.1 20.32,44.45 | C2.1 IC1.11 66.04,34.29 73.66,41.91 | C2.1 59.69,21.59 57.15,19.05 U$3.3 | U$2.16 C6.1 20.32,44.45 | IC2.8 R5.2 | IC4.8 20.32,44.45
  Bottom 0.406: R5.2 52.07,43.18 52.07,34.29 C11.+